# EAGLE design DEV_001 (EAGLE 9.6.2)
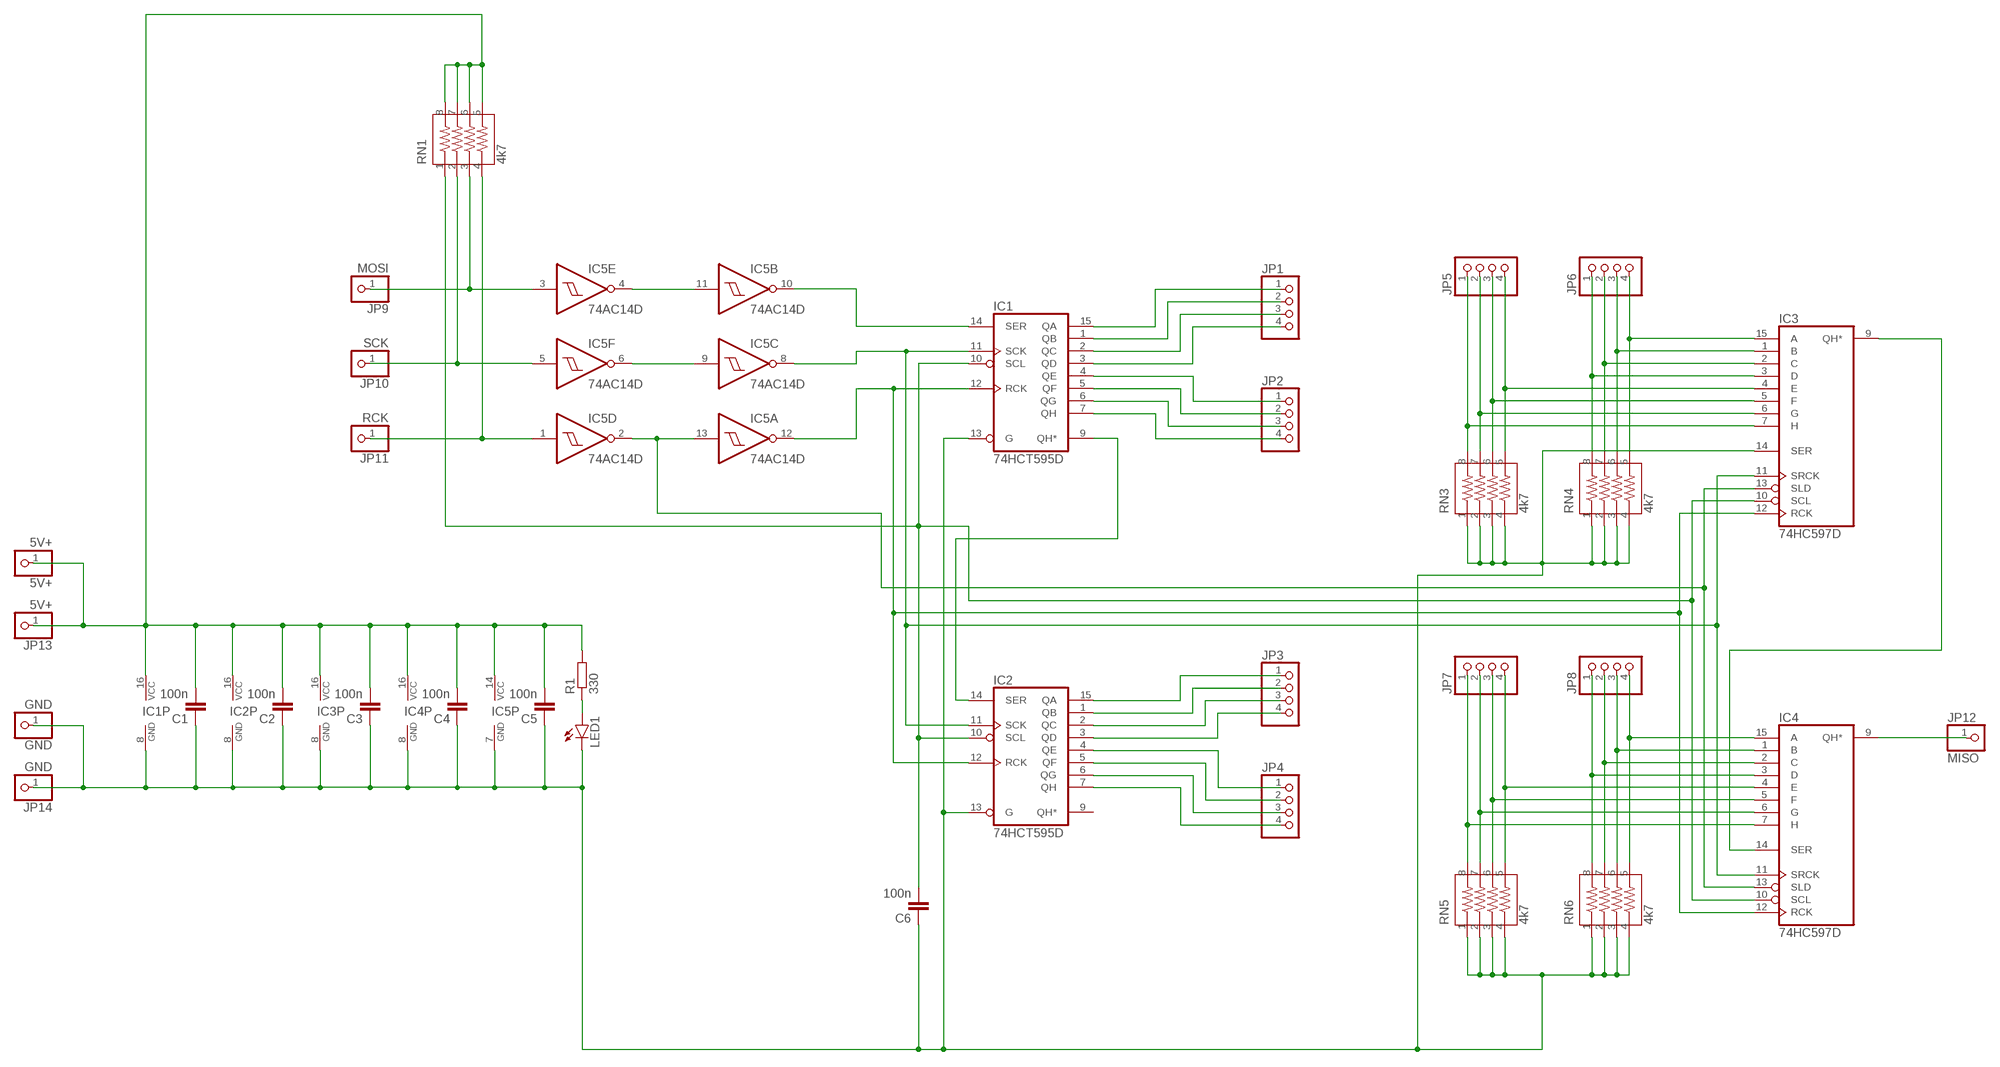
[diagram p0: schematic, sheet 1]

## Parts
5V+  5V+  PINHD-1X1  [1X01]
C1  100n  C-EUC1206K  [C1206K]
C2  100n  C-EUC1206K  [C1206K]
C3  100n  C-EUC1206K  [C1206K]
C4  100n  C-EUC1206K  [C1206K]
C5  100n  C-EUC1206K  [C1206K]
C6  100n  C-EUC1206K  [C1206K]
GND  GND  PINHD-1X1  [1X01]
IC1  74HCT595D  [SO16]
IC2  74HCT595D  [SO16]
IC3  74HC597D  [SO16]
IC4  74HC597D  [SO16]
IC5  74AC14D  [SO14]
JP1  PINHD-1X4  [1X04]
JP2  PINHD-1X4  [1X04]
JP3  PINHD-1X4  [1X04]
JP4  PINHD-1X4  [1X04]
JP5  PINHD-1X4  [1X04]
JP6  PINHD-1X4  [1X04]
JP7  PINHD-1X4  [1X04]
JP8  PINHD-1X4  [1X04]
JP9  MOSI  PINHD-1X1  [1X01]
JP10  SCK  PINHD-1X1  [1X01]
JP11  RCK  PINHD-1X1  [1X01]
JP12  MISO  PINHD-1X1  [1X01]
JP13  5V+  PINHD-1X1  [1X01]
JP14  GND  PINHD-1X1  [1X01]
LED1  LEDCHIPLED_0805  [CHIPLED_0805]
R1  330  R-EU_R1206  [R1206]
RN1  4k7  742C083103JP  [742C083103JP]
RN3  4k7  742C083103JP  [742C083103JP]
RN4  4k7  742C083103JP  [742C083103JP]
RN5  4k7  742C083103JP  [742C083103JP]
RN6  4k7  742C083103JP  [742C083103JP]

## Nets
N$1: IC5.4(E:O) IC5.11(B:I)
N$2: IC5.6(F:O) IC5.9(C:I)
N$4: IC5.3(E:I) JP9.1 RN1.3
N$5: IC5.5(F:I) JP10.1 RN1.2
N$6: IC5.1(D:I) JP11.1 RN1.4
N$7: 5V+.1 C1.2 C2.2 C3.2 C4.2 C5.2 IC1.16(VCC) IC2.16(VCC) IC3.16(VCC) IC4.16(VCC) IC5.14(P:VCC) JP13.1 R1.2 RN1.5 RN1.6 RN1.7 RN1.8
N$9: IC1.14(SER) IC5.10(B:O)
N$11: C1.1 C2.1 C3.1 C4.1 C5.1 C6.1 GND.1 IC1.8(GND) IC1.13(G) IC2.8(GND) IC2.13(G) IC3.8(GND) IC3.14(SER) IC4.8(GND) IC5.7(P:GND) JP14.1 LED1.C RN3.1 RN3.2 RN3.3 RN3.4 RN4.1 RN4.2 RN4.3 RN4.4 RN5.1 RN5.2 RN5.3 RN5.4 RN6.1 RN6.2 RN6.3 RN6.4
N$12: IC1.15(QA) JP1.1
N$13: IC1.1(QB) JP1.2
N$14: IC1.2(QC) JP1.3
N$15: IC1.3(QD) JP1.4
N$16: IC1.4(QE) JP2.1
N$17: IC1.5(QF) JP2.2
N$18: IC1.6(QG) JP2.3
N$19: IC1.7(QH) JP2.4
N$20: IC1.9(QH*) IC2.14(SER)
N$21: IC2.15(QA) JP3.1
N$22: IC2.1(QB) JP3.2
N$24: IC2.2(QC) JP3.3
N$25: IC2.3(QD) JP3.4
N$26: IC2.4(QE) JP4.1
N$27: IC2.5(QF) JP4.2
N$28: IC2.6(QG) JP4.3
N$29: IC2.7(QH) JP4.4
N$30: IC3.9(QH*) IC4.14(SER)
N$31: IC4.9(QH*) JP12.1
N$33: IC3.7(H) JP5.1 RN3.8
N$34: IC3.6(G) JP5.2 RN3.7
N$35: IC3.5(F) JP5.3 RN3.6
N$36: IC3.4(E) JP5.4 RN3.5
N$37: IC3.3(D) JP6.1 RN4.8
N$38: IC3.2(C) JP6.2 RN4.7
N$39: IC3.1(B) JP6.3 RN4.6
N$40: IC3.15(A) JP6.4 RN4.5
N$42: IC1.11(SCK) IC2.11(SCK) IC3.11(SRCK) IC4.11(SRCK) IC5.8(C:O)
N$43: IC3.13(SLD) IC4.13(SLD) IC5.2(D:O) IC5.13(A:I)
N$45: IC1.12(RCK) IC2.12(RCK) IC3.12(RCK) IC4.12(RCK) IC5.12(A:O)
N$46: IC4.7(H) JP7.1 RN5.8
N$47: IC4.6(G) JP7.2 RN5.7
N$48: IC4.5(F) JP7.3 RN5.6
N$49: IC4.4(E) JP7.4 RN5.5
N$50: IC4.3(D) JP8.1 RN6.8
N$51: IC4.2(C) JP8.2 RN6.7
N$52: IC4.1(B) JP8.3 RN6.6
N$53: IC4.15(A) JP8.4 RN6.5
N$55: LED1.A R1.1
N$64: C6.2 IC1.10(SCL) IC2.10(SCL) IC3.10(SCL) IC4.10(SCL) RN1.1
Unconnected: IC2.9(QH*)

## Library data of the parts
5V+ GND JP9-JP14 = pinhead:PINHD-1X1: PIN HEADER
C1-C6 = resistor:C-EU: CAPACITOR, European symbol
IC1 IC2 = 74xx-eu:74*595: 8-bit SHIFT REGISTER, output latch
IC3 IC4 = 74xx-eu:74*597: 8-bit SHIFT REGISTER, input latch
IC5 = 74xx-eu:74*14: Hex schmitt trigger INVERTER
JP1-JP8 = pinhead:PINHD-1X4: PIN HEADER
LED1 = led:LED: LED OSRAM: - CHIPLED LG R971, LG N971, LY N971, LG Q971, LY Q971, LO R971, LY R971 LH N974, LH R974 LS Q976, LO Q976, LY Q976 LO Q996 - Hyper CHIPLED LW Q18S LB Q993, LB Q99A, LB R99A - SideLED LS A670, LO A670, LY A670, LG A670, LP A670 LB A673, LV A673, LT A673, LW A673 LH A674 LY A675 LS A676, LA A676, LO A676, LY A676, LW A676 LS A679, LY A679, LG A679 - Hyper Micro SIDELED® LS Y876, LA Y876, LO Y876, LY Y876 LT Y87S - SmartLED LW L88C, LW L88S LB L89C, LB L89S, LG L890 LS L89K, LO L89K, LY L89K LS L896, LA L896, LO L896, LY L896 - TOPLED LS T670, LO T670, LY T670, LG T670, LP T670 LSG T670, LSP T670, LSY T670, LOP T670, LYG T670 LG T671, LOG T671, LSG T671 LB T673, LV T673, LT T673, LW T673 LH T674 LS T676, LA T676, LO T676, LY T676, LB T676, LH T676, LSB T676, LW T676 LB T67C, LV T67C, LT T67C, LS T67K, LO T67K, LY T67K, LW E67C LS E67B, LA E67B, LO E67B, LY E67B, LB E67C, LV E67C, LT E67C LW T67C LS T679, LY T679, LG T679 LS T770, LO T770, LY T770, LG T770, LP T770 LB T773, LV T773, LT T773, LW T773 LH T774 LS E675, LA E675, LY E675, LS T675 LS T776, LA T776, LO T776, LY T776, LB T776 LHGB T686 LT T68C, LB T68C - Hyper Mini TOPLED® LB M676 - Mini TOPLED Santana® LG M470 LS M47K, LO M47K, LY M47K Source: http://www.osram.convergy.de LUXEON: - LUMILED® LXK2-PW12-R00, LXK2-PW12-S00, LXK2-PW14-U00, LXK2-PW14-V00 LXK2-PM12-R00, LXK2-PM12-S00, LXK2-PM14-U00 LXK2-PE12-Q00, LXK2-PE12-R00, LXK2-PE12-S00, LXK2-PE14-T00, LXK2-PE14-U00 LXK2-PB12-K00, LXK2-PB12-L00, LXK2-PB12-M00, LXK2-PB14-N00, LXK2-PB14-P00, LXK2-PB14-Q00 LXK2-PR12-L00, LXK2-PR12-M00, LXK2-PR14-Q00, LXK2-PR14-R00 LXK2-PD12-Q00, LXK2-PD12-R00, LXK2-PD12-S00 LXK2-PH12-R00, LXK2-PH12-S00 LXK2-PL12-P00, LXK2-PL12-Q00, LXK2-PL12-R00 Source: www.luxeon.com KINGBRIGHT: KA-3528ASYC Source: www.kingbright.com
R1 = resistor:R-EU_: RESISTOR, European symbol
RN1 RN3-RN6 = Resistor Array:742C083103JP: RES ARRAY 4 RES 10K OHM 1206 Manufacturer's datasheet <https://www.ctscorp.com/wp-content/uploads/74x.pdf>; CREATED_BY: PCBLayout.com; DIGIKEY_PN: 742C083103JPTR-ND; MANUFACTURER: CTS Resistor Products; MPN: 742C083103JP; PACKAGE: 1206

## Net classes
1 ground: width 0.61 mm

## Board
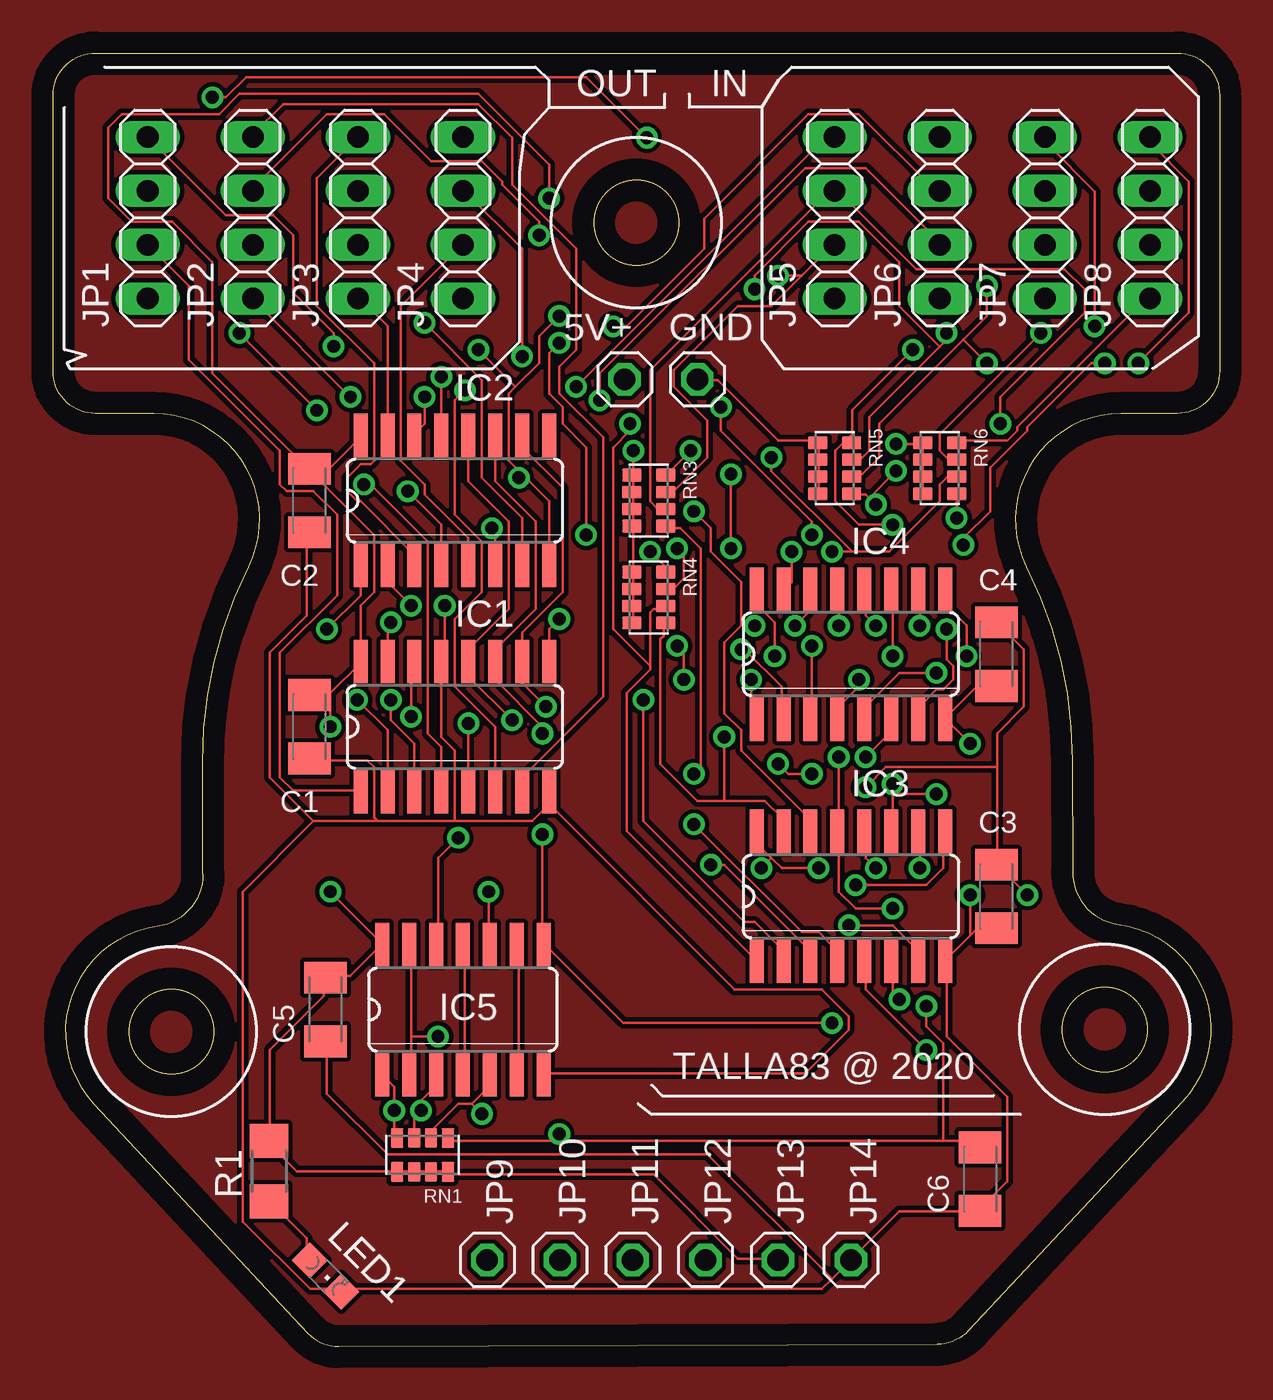
[diagram p1: board, top side]
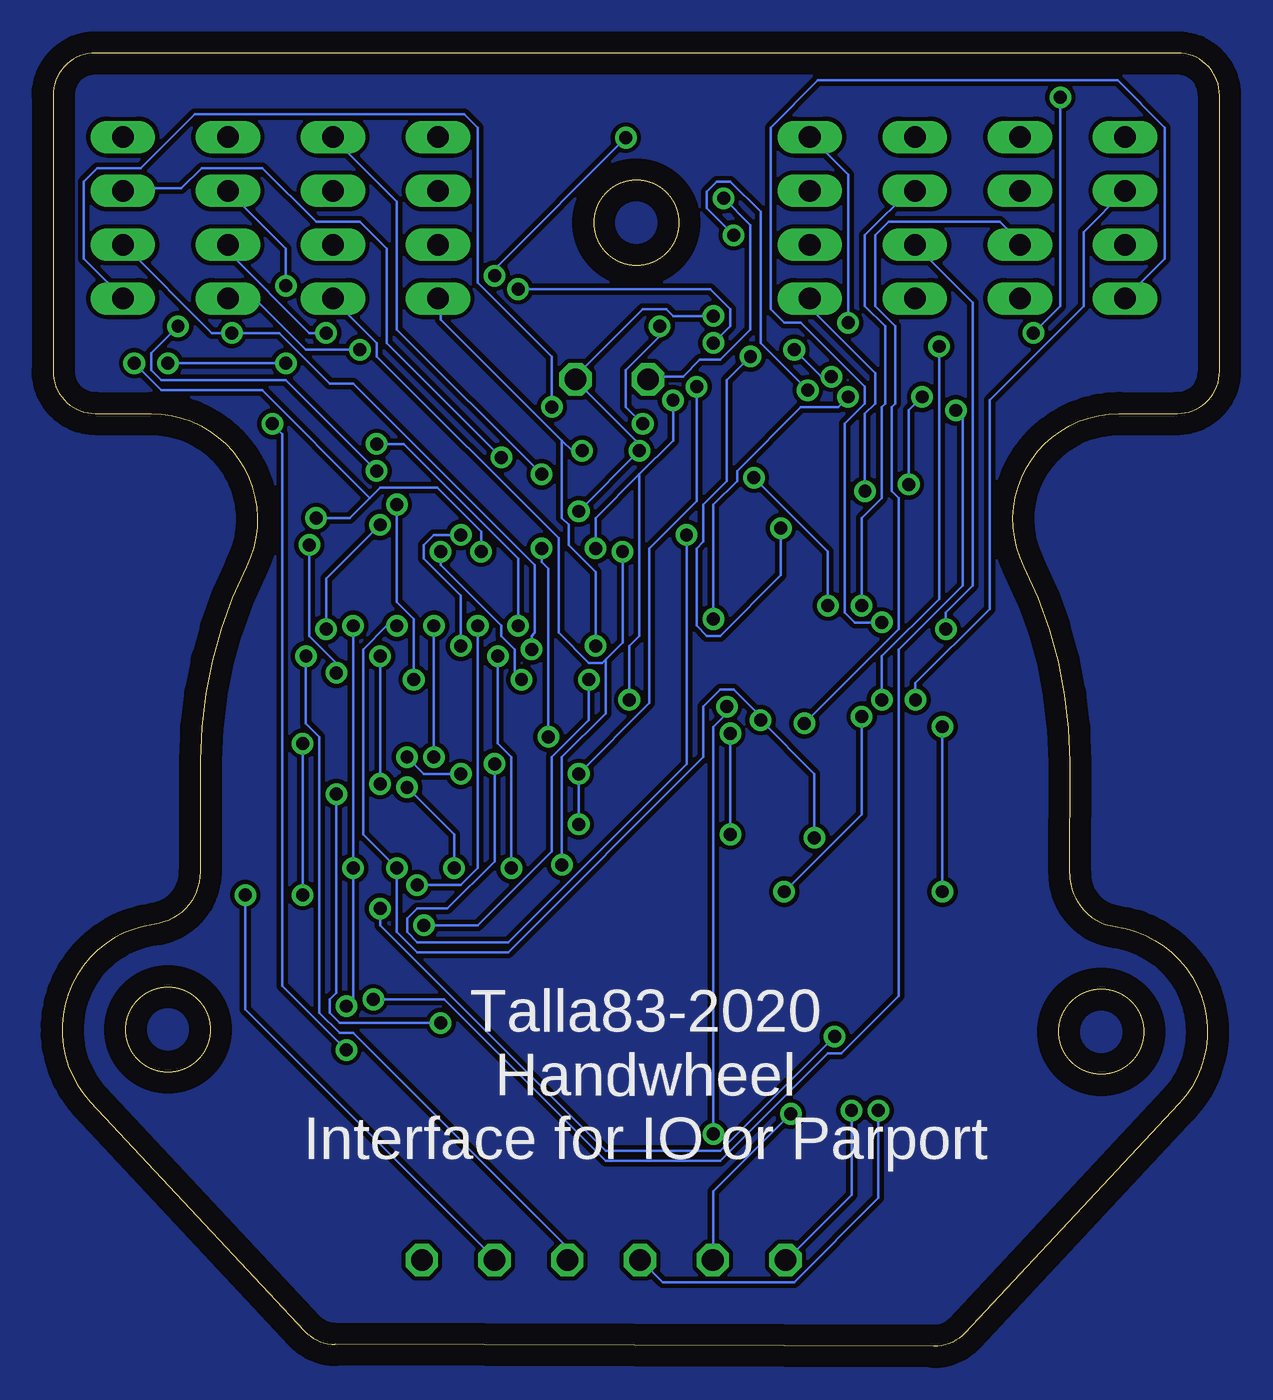
[diagram p2: board, bottom side, seen from below]

Size 55 x 61 mm. Coordinates in mm from the lower left corner, seen from the top.
Outline: 7.07,22.29 7.06,27.56 arc-27 9.22,36.77 arc117 4.75,44 2,44 arc-90 0,46 0,59 arc-90 2,61 53,61 arc-90 55,59 55,46 arc-90 53,44 50.37,44 arc117 45.89,36.77 arc-26 48.06,27.65 48.07,22.38 arc82 50.24,19.91 arc-125 53.23,11.54 43.15,0.74 arc-47 41.69,0.1 13.47,0 arc-47 12.01,0.64 1.93,11.44 arc-125 4.92,19.8 arc82 7.07,22.29
Outline: circle at 27.5,53 radius 2
Outline: circle at 49.58,14.95 radius 2
Outline: circle at 5.58,14.85 radius 2
Copper layers (1*16): Top 0.035mm / dielectric 1.5mm / Bottom 0.035mm
Design rules "default *": minimum track width 5mil, minimum drill 24mil, track to track 8mil, track to pad 8mil, pad to pad 8mil, via to via 8mil, smd to smd 8mil, copper to edge 40mil, drill to drill 8mil, minimum pad ring 10mil, minimum via ring 8mil, stop-mask expansion 4mil, vias tented up to drill 0mil, thermal gap 10mil

### Footprints (pad centres in the part's own frame; a part is rotated, then mirrored left to right if it is on the bottom)
1X01 = drill 1.016 octagon: 1 0,0
C1206K = smd 1.5 x 2: 1 -1.5,0; 2 1.5,0
SO16 = smd 0.66 x 2.032: 1 -4.445,-3.073; 2 -3.175,-3.073; 3 -1.905,-3.073; 4 -0.635,-3.073; 5 0.635,-3.073; 6 1.905,-3.073; 7 3.175,-3.073; 8 4.445,-3.073; 9 4.445,3.073; 10 3.175,3.073; 11 1.905,3.073; 12 0.635,3.073; 13 -0.635,3.073; 14 -1.905,3.073; 15 -3.175,3.073; 16 -4.445,3.073
SO14 = smd 0.66 x 2.032: 1 -3.81,-3.073; 2 -2.54,-3.073; 3 -1.27,-3.073; 4 0,-3.073; 5 1.27,-3.073; 6 2.54,-3.073; 7 3.81,-3.073; 8 3.81,3.073; 9 2.54,3.073; 10 1.27,3.073; 11 0,3.073; 12 -1.27,3.073; 13 -2.54,3.073; 14 -3.81,3.073
1X04 = drill 1.016 long: 1 -3.81,0; 2 -1.27,0; 3 1.27,0; 4 3.81,0
CHIPLED_0805 = smd 1.2 x 1.2: A 0,-1.05; C 0,1.05
R1206 = smd 1.6 x 1.803: 1 -1.422,0; 2 1.422,0
742C083103JP = smd 0.59 x 0.92: 1 -1.2,-0.8; 2 -0.4,-0.8; 3 0.4,-0.8; 4 1.2,-0.8; 5 1.2,0.8; 6 0.4,0.8; 7 -0.4,0.8; 8 -1.2,0.8

### Placement (x,y rotation side)
5V+  26.95,45.61 0 top
C1  12.09,29.23 90 top
C2  12.09,39.9 90 top
C3  44.47,21.23 90 top
C4  44.47,32.66 90 top
C5  12.85,15.89 90 top
C6  43.71,7.89 90 top
GND  30.37,45.61 0 top
IC1  18.94,29.23 0 top
IC2  18.94,39.9 0 top
IC3  37.61,21.23 0 top
IC4  37.61,32.66 0 top
IC5  19.33,15.89 0 top
JP1  4.47,53.23 90 top
JP2  9.42,53.23 90 top
JP3  14.37,53.23 90 top
JP4  19.33,53.23 90 top
JP5  36.85,53.23 90 top
JP6  41.8,53.23 90 top
JP7  46.76,53.23 90 top
JP8  51.71,53.23 90 top
JP9  20.47,4.08 0 top
JP10  23.9,4.08 0 top
JP11  27.33,4.08 0 top
JP12  30.76,4.08 0 top
JP13  34.18,4.08 0 top
JP14  37.61,4.08 0 top
LED1  12.85,3.32 225 top
R1  10.18,8.27 90 top
RN1  17.42,9.03 180 top
RN3  28.09,39.9 270 top
RN4  28.09,35.32 270 top
RN5  36.85,41.42 270 top
RN6  41.8,41.42 270 top

### Tracks (layer width: path | path; a pad name or v marks a point on that pad's centre or on a via)
BOT
  pour Bottom: -5.01,-4.35 -5.01,63.66 57.75,63.66 57.75,-4.35
N$1
  Top 0.127: IC5.4 19.42,12.88 19.42,18.91 IC5.11
N$2
  Top 0.127: IC5.6 21.96,12.88 21.96,18.91 IC5.9
N$4  (via drill 0.61)
  Top 0.127: 17.04,11.13 17.04,11.29 17.99,12.24 17.99,12.72 IC5.3 | 17.04,11.13 17.04,9.86 RN1.3 | v17.36,11.13 17.04,11.13
  Bottom 0.127: v17.36,11.13 17.36,7.16 20.37,4.15 JP9.1
N$5  (via drill 0.61)
  Top 0.127: 19.74,11.45 19.1,11.45 17.83,10.18 17.83,9.86 RN1.2 | 19.74,11.45 20.53,12.24 20.53,12.72 IC5.5 | 19.74,11.45 v20.21,10.97
  Bottom 0.127: v20.21,10.97 23.87,7.32 23.87,4.15 JP10.1
N$6  (via drill 0.61)
  Top 0.127: RN1.4 16.09,9.86 v16.09,11.13 16.09,12.24 15.61,12.72 IC5.1
  Bottom 0.127: v16.09,11.13 16.09,7 20.06,3.03 26.25,3.03 27.2,3.99 JP11.1
N$7  (via drill 0.61)
  Top 0.127: 13.07,30.82 12.12,30.82 C1.2 13.07,30.82 | 13.07,30.82 14.5,32.24 IC1.16 14.5,34.94 15.13,35.58 15.13,38.28 12.12,41.29 C2.2 | C2.2 12.12,41.45 13.07,41.45 14.5,42.88 IC2.16 | v23.39,54.15 23.39,55.74 20.06,59.07 8.78,59.07 7.83,58.12 3.23,58.12 2.59,57.49 2.59,54.15 3.7,53.04 5.61,53.04 7.51,51.14 7.51,45.9 11.96,41.45 C2.2 | 44.5,27.32 44.5,28.91 45.77,30.18 45.77,32.88 44.5,34.15 C4.2 | 44.5,27.32 44.5,22.88 C3.2 44.5,22.72 v45.93,21.29 | 33.87,23.04 34.34,22.56 v36.09,22.56 | 33.87,23.04 33.23,23.67 33.23,24.15 IC3.16 | v38.31,26.37 39.26,27.32 44.5,27.32 | v34.03,32.56 34.03,34.15 33.23,34.94 33.23,35.58 IC4.16 | 33.87,23.04 v33.39,22.56 | JP13.1 34.18,4.15 32.28,4.15 28.31,8.11 18.63,8.11 RN1.8 18.47,8.27 17.83,8.27 RN1.7 17.67,8.27 17.04,8.27 RN1.6 16.88,8.27 16.25,8.27 RN1.5 16.09,8.27 11.48,8.27 10.21,9.54 R1.2 10.21,9.7 10.21,13.99 12.75,16.53 12.75,17.32 C5.2 12.91,17.48 14.02,17.48 15.45,18.91 IC5.14 15.45,19.07 v13.07,21.45 | v13.07,29.23 13.07,30.82
  Bottom 0.127: v23.39,54.15 22.12,52.88 22.12,47.96 23.55,46.53 24.5,46.53 25.29,45.74 26.88,45.74 5V+.1 | v36.09,22.56 36.09,24.15 v38.31,26.37 | v34.03,32.56 34.03,28.43 33.39,27.8 v33.39,22.56 | v45.93,21.29 45.93,15.89 34.18,4.15 JP13.1 | v13.07,21.45 v13.07,29.23
N$9  (via drill 0.61)
  Top 0.127: v20.53,21.45 20.53,19.07 IC5.10 | v16.88,29.7 16.88,32.09 17.04,32.24 IC1.14
  Bottom 0.127: v20.53,21.45 16.88,25.1 v16.88,29.7
N$11  (via drill 0.61)
  Top 0.127: C4.1 44.34,31.13 43.55,31.13 42.12,29.7 IC4.8 42.12,29.54 v43.23,28.43 | 43.23,19.39 42.12,18.27 IC3.8 42.12,18.11 42.12,14.62 44.98,11.77 44.98,7.8 43.71,6.53 C6.1 43.71,6.37 39.9,6.37 JP14.1 36.72,3.19 | 43.23,19.39 43.55,19.7 44.34,19.7 C3.1 | 36.72,3.19 36.25,2.72 13.71,2.72 LED1.C 13.55,2.72 12.12,2.72 8.94,5.89 8.94,21.45 12.28,24.78 | 36.72,3.19 30.85,9.07 15.77,9.07 12.91,11.92 12.91,14.3 C5.1 | 43.23,19.39 v43.23,21.29 | RN6.4 41.01,40.34 41.01,40.97 RN6.3 41.01,41.13 41.01,41.77 RN6.2 41.01,41.93 41.01,42.56 RN6.1 40.85,42.56 v39.74,42.56 | 32.44,33.99 v33.07,33.99 | 32.44,33.99 31.64,33.2 31.64,29.86 32.44,29.07 32.44,28.12 35.61,24.94 35.61,24.31 IC3.14 | RN4.4 27.36,34.15 27.36,34.78 RN4.3 27.36,34.94 27.36,35.58 RN4.2 27.36,35.74 27.36,36.37 RN4.1 27.36,36.53 27.36,38.59 RN3.4 27.36,38.75 27.36,39.39 RN3.3 27.36,39.55 27.36,40.18 RN3.2 27.36,40.34 27.36,40.97 RN3.1 27.36,41.13 v27.36,42.25 | RN5.4 36.09,40.34 36.09,40.97 RN5.3 36.09,41.13 36.09,41.77 RN5.2 36.09,41.93 36.09,42.56 RN5.1 35.93,42.72 34.18,42.72 31.33,45.58 30.37,45.58 GND.1 | IC2.8 23.39,39.86 22.12,41.13 | 22.12,41.13 21.48,41.77 21.48,44.94 21.8,45.26 | 21.8,45.26 22.91,46.37 22.91,47.64 v23.87,48.6 | v18.31,45.74 IC2.13 | 21.8,45.26 v20.06,47.01 | 32.44,33.99 32.44,36.05 31.01,37.48 31.01,38.59 v30.22,39.39 | 15.29,24.78 15.13,24.94 15.13,27.32 14.82,27.64 12.12,27.64 C1.1 | 18.94,24.78 22.6,24.78 23.39,25.58 | 18.94,24.78 15.29,24.78 | IC1.8 23.39,25.58 | 12.28,24.78 10.21,26.85 10.21,32.72 11.96,34.47 11.96,38.28 C2.1 | 15.29,24.78 12.28,24.78 | 23.39,25.58 32.12,16.84 36.25,16.84 37.52,15.57 37.52,14.94 35.45,12.88 23.23,12.88 IC5.7
  Top 0.127: 18.94,24.78 18.94,28.12 18.31,28.75 IC1.13 18.31,32.4 18.47,32.56 v18.47,34.94 | v21.96,40.97 22.12,41.13
  Bottom 0.127: v43.23,21.29 v43.23,28.43 | v39.74,42.56 38.47,42.56 33.07,37.17 v33.07,33.99 | v23.87,48.6 25.77,48.6 26.09,48.91 27.2,48.91 30.37,45.74 GND.1 30.37,45.58 27.36,42.56 v27.36,42.25 v30.22,39.39 | v18.31,45.74 18.79,45.74 v20.06,47.01 | v21.96,40.97 18.47,37.48 v18.47,34.94
N$12  (via drill 0.61)
  Top 0.127: IC1.15 15.77,33.99 v15.93,34.15
  Bottom 0.127: v15.93,34.15 17.2,34.15 17.67,34.62 17.67,43.51 16.72,44.47 16.72,45.26 19.74,48.28 20.53,48.28 21.17,48.91 21.17,57.49 18.94,59.71 4.82,59.71 2.59,57.49 2.59,51.29 JP1.1
N$13
  Top 0.127: JP1.2 6.4,50.02 6.4,46.53 10.69,42.25 10.69,40.66 11.01,40.34 12.28,40.34 13.39,39.23 13.39,35.42 10.69,32.72 10.69,26.85 11.32,26.21 14.5,26.21 IC1.1
N$14  (via drill 0.61)
  Top 0.127: IC1.2 15.77,29.07 v14.34,30.5
  Bottom 0.127: v14.34,30.5 14.34,31.29 10.85,34.78 10.85,44.63 6.4,49.07 6.4,52.56 JP1.3
N$15  (via drill 0.61)
  Top 0.127: IC1.3 17.04,28.43 15.93,29.54 v15.93,30.5 | v13.23,47.17 13.23,47.8 11.32,49.71 11.32,52.4 10.37,53.36 8.15,53.36 JP1.4
  Bottom 0.127: v15.93,30.5 15.93,32.56 13.23,35.26 v13.23,47.17
N$16  (via drill 0.61)
  Top 0.127: IC1.4 18.31,28.27 17.67,28.91 17.67,37.96 14.98,40.66 v14.66,40.66 | v14.02,44.79 9.42,49.39 JP2.1
  Bottom 0.127: v14.66,40.66 14.66,44.15 v14.02,44.79
N$17  (via drill 0.61)
  Top 0.127: v19.58,29.39 IC1.5
  Bottom 0.127: v19.58,29.39 15.13,33.83 15.13,40.02 15.45,40.34 15.45,44.31 15.29,44.47 15.29,48.12 16.25,49.07 16.25,52.4 15.61,53.04 10.37,53.04 9.42,52.09 JP2.2
N$18  (via drill 0.61)
  Top 0.127: IC1.6 20.85,29.23 18.94,31.13 18.94,34.31 20.21,35.58 20.21,37.96 18.94,39.23 18.94,44.63 v19.42,45.1 | v22.91,52.4 22.91,53.04 21.17,54.79 21.17,54.94 20.21,55.9 17.83,55.9 15.61,58.12 12.91,58.12 9.42,54.63 JP2.3
  Bottom 0.127: v19.42,45.1 21.64,47.32 21.64,53.52 23.07,54.94 23.71,54.94 24.18,54.47 24.18,53.68 v22.91,52.4
N$19
  Top 0.127: IC1.7 22.12,26.85 25.93,30.66 25.93,42.88 23.87,44.94 23.87,46.21 24.66,47.01 24.66,51.77 21.64,54.79 21.64,57.01 20.06,58.6 10.85,58.6 9.42,57.17 JP2.4
N$20  (via drill 0.61)
  Top 0.127: IC1.9 23.39,33.83 v23.87,34.31 | v17.52,44.79 17.52,43.51 17.04,43.04 IC2.14
  Bottom 0.127: v23.87,34.31 23.87,39.71 22.75,40.82 22.75,41.29 19.74,44.31 17.99,44.31 v17.52,44.79
N$21
  Top 0.127: IC2.15 15.77,48.12 14.5,49.39 JP3.1
N$22  (via drill 0.61)
  Top 0.127: IC2.1 14.5,35.42 v12.91,33.83
  Bottom 0.127: v12.91,33.83 12.91,34.62 11.64,35.89 11.64,49.23 JP3.2
N$24  (via drill 0.61)
  Top 0.127: IC2.2 15.77,36.05 v16.88,34.94
  Bottom 0.127: v16.88,34.94 16.88,39.07 15.93,40.02 15.93,44.31 15.77,44.47 15.77,48.12 16.72,49.07 16.72,52.4 14.5,54.63 JP3.3
N$25
  Top 0.127: IC2.3 17.04,37.32 14.5,39.86 14.34,39.86 13.86,40.34 13.86,40.97 14.5,41.61 14.98,41.61 15.13,41.77 15.13,46.37 12.44,49.07 12.44,55.1 JP3.4
N$26  (via drill 0.61)
  Top 0.127: IC2.4 18.31,38.75 v16.72,40.34
  Bottom 0.127: v16.72,40.34 16.72,43.99 16.25,44.47 16.25,45.9 19.26,48.91 19.26,49.39 JP4.1
N$27
  Top 0.127: IC2.5 19.58,38.12 17.52,40.18 17.52,40.66 16.4,41.77 16.4,49.07 19.26,51.93 JP4.2
N$28  (via drill 0.61)
  Top 0.127: IC2.6 20.85,38.43 v20.69,38.59 | v22.12,46.69 22.12,51.77 19.42,54.47 JP4.3
  Bottom 0.127: v20.69,38.59 20.69,36.37 23.55,33.51 24.18,33.51 24.66,33.99 24.66,37.64 24.34,37.96 24.34,39.71 23.23,40.82 23.23,45.58 v22.12,46.69
N$29  (via drill 0.61)
  Top 0.127: IC2.7 22.12,39.07 20.21,40.97 20.21,45.58 v17.52,48.28
  Bottom 0.127: v17.52,48.28 17.52,55.26 19.26,57.01 JP4.4
N$30  (via drill 0.61)
  Top 0.127: v34.98,33.99 35.61,34.62 35.61,35.58 IC4.14 | v37.84,21.77 41.17,21.77 41.96,22.56 41.96,24.15 IC3.9
  Bottom 0.127: v34.98,33.99 34.98,22.56 35.77,21.77 v37.84,21.77
N$31  (via drill 0.61)
  Top 0.127: v43.07,32.56 43.07,33.99 42.12,34.94 42.12,35.58 IC4.9
  Bottom 0.127: v43.07,32.56 43.07,29.39 42.44,28.75 42.44,15.73 41.49,14.78 40.85,14.78 30.85,4.78 30.85,4.15 JP12.1
N$33  (via drill 0.61)
  Top 0.127: v30.06,42.25 28.95,41.13 RN3.8 | v37.52,19.86 39.58,19.86 40.69,18.75 40.69,18.27 IC3.7 | v29.74,31.45 29.74,32.72 v29.42,33.04
  Bottom 0.127: v30.06,42.25 30.53,42.25 31.01,42.72 | 31.01,42.72 36.72,48.44 36.72,49.39 JP5.1 | v37.52,19.86 34.98,19.86 31.49,23.35 31.49,27.8 29.74,29.54 v29.74,31.45 | v29.42,33.04 29.42,36.53 30.69,37.8 30.69,38.75 31.01,39.07 31.01,42.72
N$34  (via drill 0.61)
  Top 0.127: 35.3,50.5 36.72,51.93 JP5.2 | 35.3,50.5 33.87,49.07 32.28,49.07 29.26,46.06 29.26,45.26 30.85,43.67 30.85,41.93 29.26,40.34 28.95,40.34 RN3.7 | v39.9,16.37 39.58,16.69 39.58,18.11 IC3.6 | v8.78,47.8 v12.44,44.15 | v7.51,58.91 8.15,58.91 9.1,59.87 25.14,59.87 v27.99,57.01 | 35.3,50.5 v34.18,50.5
  Bottom 0.127: v39.9,16.37 36.57,16.37 28.95,8.75 23.55,8.75 18.47,13.83 17.83,13.83 15.13,16.53 15.13,32.88 12.12,35.89 12.12,43.83 v12.44,44.15 | v8.78,47.8 7.51,49.07 v7.51,58.91 | v27.99,57.01 34.18,50.82 v34.18,50.5
N$35  (via drill 0.61)
  Top 0.127: RN3.6 28.79,39.55 28.47,39.55 28.15,39.86 28.15,46.06 36.72,54.63 JP5.3 36.88,54.63 40.69,50.82 47.68,50.82 48.63,49.86 48.63,48.75 44.66,44.79 v44.66,43.51 | v41.17,13.99 38.31,16.84 38.31,18.11 IC3.5
  Bottom 0.127: v41.17,13.99 44.19,17 44.19,43.04 v44.66,43.51
N$36  (via drill 0.61)
  Top 0.127: v30.22,27 30.53,27.32 30.53,37.64 29.58,38.59 28.95,38.59 RN3.5 | v30.22,24.62 35.3,19.54 36.09,19.54 36.88,18.75 36.88,18.27 IC3.4 | v24.66,45.26 36.41,57.01 36.72,57.01 JP5.4
  Bottom 0.127: v30.22,24.62 v30.22,27 26.88,30.34 26.88,37.64 24.66,39.86 v24.66,45.26
N$37  (via drill 0.61)
  Top 0.127: v28.15,37.48 28.79,36.85 28.79,36.53 RN4.8 | v31.01,22.72 31.64,22.72 35.61,18.75 35.61,18.27 IC3.3
  Bottom 0.127: v28.15,37.48 28.15,33.2 28.95,32.4 | 28.95,32.4 29.1,32.24 29.74,32.24 31.17,33.67 31.17,38.12 39.74,46.69 39.74,47.32 41.8,49.39 JP6.1 | v31.01,22.72 31.01,27.8 28.95,29.86 28.95,32.4
N$38  (via drill 0.61)
  Top 0.127: v29.42,37.64 29.74,37.32 29.74,36.21 29.26,35.74 28.95,35.74 RN4.7 | v25.77,44.63 25.77,45.9 35.45,55.58 38.31,55.58 41.8,52.09 JP6.2 | v27.83,30.5 27.83,24.78 32.6,20.02 33.07,20.02 34.34,18.75 34.34,18.27 IC3.2
  Bottom 0.127: v29.42,37.64 29.42,39.07 27.36,41.13 | 27.36,41.13 25.77,42.72 v25.77,44.63 | v27.83,30.5 27.83,33.04 27.36,33.51 27.36,41.13
N$39  (via drill 0.61)
  Top 0.127: 28.15,32.09 28.15,31.93 27.04,30.82 27.04,24.31 33.07,18.27 IC3.1 | 28.15,32.09 28.15,34.62 28.31,34.78 28.79,34.78 RN4.6 | v26.41,48.12 27.04,48.12 30.69,51.77 30.69,53.2 35.61,58.12 37.99,58.12 41.49,54.63 41.8,54.63 JP6.3 | v27.2,43.51 27.2,43.2 26.41,42.4 26.41,33.83 28.15,32.09
  Bottom 0.127: v26.41,48.12 26.41,47.64 27.99,46.06 27.99,44.31 v27.2,43.51
N$40  (via drill 0.61)
  Top 0.127: 31.64,25.73 33.55,25.73 34.34,24.94 34.34,24.31 IC3.15 | 31.64,25.73 30.37,25.73 28.63,27.48 28.63,33.36 28.79,33.51 28.79,33.99 RN4.5 | v31.96,37.64 v31.96,41.13 | 31.64,25.73 v31.64,28.75
  Bottom 0.127: v31.96,41.13 38.79,47.96 38.79,53.99 41.8,57.01 JP6.4 | v31.96,37.64 31.96,37.01 31.64,36.69 v31.64,28.75
N$42  (via drill 0.61)
  Top 0.127: 39.58,26.05 39.58,24.31 IC3.11 | v39.58,32.56 39.58,35.58 IC4.11 | v23.07,24.15 23.07,19.07 IC5.8 23.23,18.91 26.88,15.26 v36.72,15.26 | v23.07,28.91 23.07,29.23 20.85,31.45 IC1.11 20.85,32.88 22.75,34.78 22.75,38.91 20.85,40.82 IC2.11 | v41.65,26.05 39.58,26.05 | 39.58,26.05 v39.58,26.53
  Bottom 0.127: v39.58,32.56 v39.58,26.53 | v23.07,28.91 v23.07,24.15 | v41.65,26.05 41.65,16.69 41.96,16.37 41.96,15.73 41.49,15.26 v36.72,15.26
N$43  (via drill 0.61)
  Top 0.127: 16.88,14.62 16.88,18.91 IC5.13 | 16.88,14.62 16.88,12.88 IC5.2 | v37.04,27.8 37.04,24.31 IC3.13 37.04,24.15 37.04,21.45 37.84,20.66 v39.58,20.66 | v37.04,33.99 37.04,35.58 IC4.13 | v18.15,14.62 16.88,14.62
  Bottom 0.127: v37.04,33.99 v37.04,27.8 | v18.15,14.62 23.55,9.22 28.95,9.22 39.58,19.86 v39.58,20.66
N$45  (via drill 0.61)
  Top 0.127: v19.1,23.99 18.15,23.04 18.15,19.07 IC5.12 | v21.64,29.54 19.58,31.61 IC1.12 19.58,32.88 21.48,34.78 21.48,38.91 19.58,40.82 IC2.12 | v38.79,22.56 38.31,23.04 38.31,24.15 IC3.12 | v38.79,33.99 38.31,34.47 38.31,35.58 IC4.12
  Bottom 0.127: v19.1,23.99 19.1,27 v21.64,29.54 21.64,29.7 22.91,30.97 23.55,30.97 24.34,30.18 24.34,27.8 33.55,18.59 37.84,18.59 38.79,19.54 v38.79,22.56 40.38,24.15 40.38,32.88 39.26,33.99 v38.79,33.99
N$46  (via drill 0.61)
  Top 0.127: 37.68,43.04 37.68,44.15 v40.53,47.01 | 37.68,43.04 37.68,42.72 RN5.8 | v42.12,33.83 42.12,32.4 42.44,32.09 42.44,31.45 41.96,30.97 41.65,30.97 40.85,30.18 40.85,29.7 IC4.7 | v39.58,38.75 37.99,38.75 36.88,39.86 36.88,42.25 37.68,43.04
  Bottom 0.127: v40.53,47.01 43.07,47.01 45.46,49.39 46.73,49.39 JP7.1 | v42.12,33.83 42.12,36.21 v39.58,38.75
N$47  (via drill 0.61)
  Top 0.127: 41.8,47.17 42.12,47.48 v42.12,47.8 | 41.8,47.17 38.47,43.83 38.47,42.25 38.15,41.93 37.68,41.93 RN5.7 | v38.31,27.8 39.42,28.91 39.42,29.54 IC4.6 | v35.77,27 34.66,27 v34.18,27.48 | v25.14,38.28 25.14,42.4 24.02,43.51 24.02,44.31 23.39,44.94 23.39,46.85 v23.87,47.32 | v33.07,49.86 33.07,50.5 35.61,53.04 37.99,53.04 39.9,51.14 39.9,49.07 41.8,47.17
  Bottom 0.127: v42.12,47.8 42.92,47.8 46.73,51.61 46.73,51.93 JP7.2 | v38.31,27.8 37.52,27 v35.77,27 | v34.18,27.48 34.18,22.88 36.41,20.66 37.84,20.66 38.31,20.18 38.31,19.54 37.84,19.07 33.55,19.07 25.14,27.48 v25.14,38.28 | v23.87,47.32 23.07,48.12 23.07,48.91 24.02,49.86 v33.07,49.86
N$48  (via drill 0.61)
  Top 0.127: 42.92,47.48 44.03,48.6 v44.03,50.02 | 42.92,47.48 38.95,43.51 38.95,41.93 38.15,41.13 37.68,41.13 RN5.6 | v41.65,31.77 39.9,31.77 38.31,30.18 38.31,29.7 IC4.5 | v42.92,37.8 42.92,38.12 44.19,39.39 44.19,41.45 45.93,43.2 45.93,43.36 48.95,46.37 v49.58,46.37 | 42.92,47.48 v44.03,46.37
  Bottom 0.127: v44.03,50.02 44.03,51.77 JP7.3 | v41.65,31.77 41.65,32.24 42.92,33.51 v42.92,37.8 | v44.03,46.37 v49.58,46.37
N$49  (via drill 0.61)
  Top 0.127: 38.47,40.02 38.31,40.18 37.68,40.18 RN5.5 | v37.99,31.45 37.99,31.13 37.04,30.18 37.04,29.7 IC4.4 | v49.11,48.12 49.11,54.47 46.88,56.69 46.88,57.01 JP7.4 | 38.47,40.02 v39.74,41.29 | 38.47,40.02 v38.79,39.71
  Bottom 0.127: v38.79,39.71 38.79,35.1 37.99,34.31 v37.99,31.45 | v49.11,48.12 50.38,46.85 50.38,46.06 49.9,45.58 44.03,45.58 v39.74,41.29
N$50  (via drill 0.61)
  Top 0.127: RN6.8 42.76,42.72 44.98,42.72 45.46,43.2 45.46,43.36 51.65,49.55 JP8.1 | v35.77,33.04 35.77,29.7 IC4.3 | v35.77,38.28 35.77,38.91 31.49,43.2 v31.49,44.31
  Bottom 0.127: v35.77,33.04 35.77,35.42 37.52,37.17 37.52,37.8 37.04,38.28 v35.77,38.28 | v31.49,44.31 31.49,46.69 34.98,50.18 34.98,57.49 35.61,58.12 48.31,58.12 50.85,55.58 52.92,55.58 53.55,54.94 53.55,51.29 51.81,49.55 JP8.1
N$51  (via drill 0.61)
  Top 0.127: v46.57,47.8 41.8,43.04 41.8,42.25 42.12,41.93 42.6,41.93 RN6.7 | v32.44,32.88 32.6,32.88 34.34,31.13 34.34,29.7 IC4.2
  Bottom 0.127: JP8.2 51.65,51.93 47.52,47.8 v46.57,47.8 44.34,47.8 41.96,45.42 40.85,45.42 32.28,36.85 32.28,33.67 32.44,33.51 v32.44,32.88
N$52  (via drill 0.61)
  Top 0.127: v36.72,37.48 37.68,37.48 | 37.68,37.48 39.42,37.48 41.8,39.86 41.8,40.66 42.12,40.97 42.6,40.97 RN6.6 | v32.91,31.45 32.91,29.86 33.07,29.7 IC4.1 | v33.87,41.93 33.87,41.29 37.68,37.48
  Bottom 0.127: v36.72,37.48 36.72,36.85 33.87,33.99 33.87,33.51 33.23,32.88 33.23,31.77 v32.91,31.45 | v33.87,41.93 39.26,47.32 39.26,51.77 40.53,53.04 42.6,53.04 45.14,55.58 48,55.58 48.95,54.63 51.65,54.63 JP8.3
N$53  (via drill 0.61)
  Top 0.127: v42.6,39.07 42.6,40.18 RN6.5 | v34.82,37.48 34.82,36.05 34.5,35.74 IC4.15 | v51.17,46.37 53.55,48.75 53.55,54.94 51.81,56.69 51.81,57.01 JP8.4
  Bottom 0.127: v42.6,39.07 41.01,39.07 40.06,40.02 | 40.06,40.02 39.58,40.5 36.88,40.5 34.82,38.43 v34.82,37.48 | v51.17,46.37 49.9,45.1 45.14,45.1 40.06,40.02
N$55
  Top 0.127: LED1.A 11.96,4.15 11.96,5.1 10.21,6.84 R1.1
N$64  (via drill 0.61)
  Top 0.127: v40.85,22.56 40.85,24.15 IC3.10 | v40.85,33.99 40.85,35.58 IC4.10 | IC2.10 22.12,42.4 24.02,40.5 24.02,35.58 22.12,33.67 IC1.10 22.12,31.29 v23.23,30.18 | 41.96,9.7 43.55,9.7 43.71,9.54 C6.2 | 41.96,9.7 23.87,9.7 | 23.87,9.7 18.63,9.7 RN1.1 | 23.87,9.7 v23.87,10.02 | v41.17,16.05 41.17,15.1 41.96,14.3 41.96,9.7
  Bottom 0.127: v40.85,33.99 v40.85,22.56 40.85,16.37 v41.17,16.05 | v23.23,30.18 23.23,29.86 23.87,29.23 v23.87,10.02
TOP
  pour Top: -3.01,-15.35 -3.01,66.28 63.4,66.28 63.4,-15.35

### Text on the board
tNames: OUT | IN | TALLA83 @ 2020
bNames: Talla83-2020 / Handwheel / Interface for IO or Parport